# EAGLE design LDR 01 (EAGLE 8.0.2)
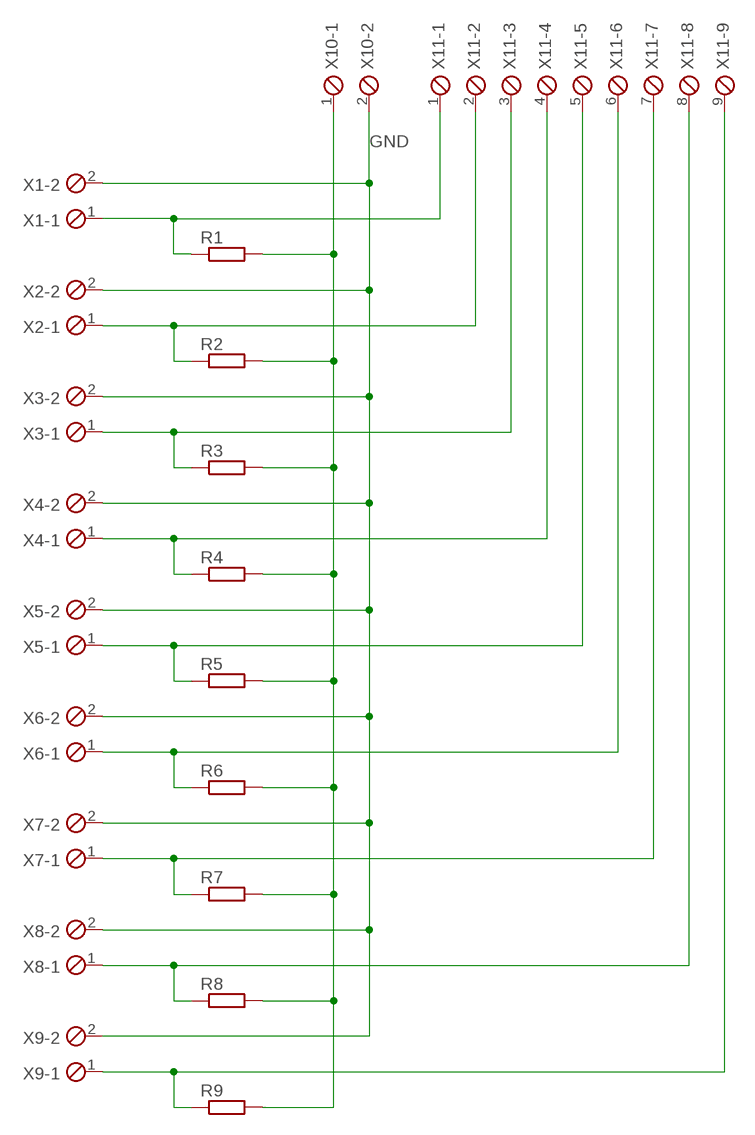
[diagram p0: schematic, sheet 1]

## Parts
R1  R-EU_0204/7  [0204/7]
R2  R-EU_0204/7  [0204/7]
R3  R-EU_0204/7  [0204/7]
R4  R-EU_0204/7  [0204/7]
R5  R-EU_0204/7  [0204/7]
R6  R-EU_0204/7  [0204/7]
R7  R-EU_0204/7  [0204/7]
R8  R-EU_0204/7  [0204/7]
R9  R-EU_0204/7  [0204/7]
X1  MPT2  [2POL254]
X2  MPT2  [2POL254]
X3  MPT2  [2POL254]
X4  MPT2  [2POL254]
X5  MPT2  [2POL254]
X6  MPT2  [2POL254]
X7  MPT2  [2POL254]
X8  MPT2  [2POL254]
X9  MPT2  [2POL254]
X10  MPT2  [2POL254]
X11  MPT9  [9POL254]

## Nets
GND: X1.2 X2.2 X3.2 X4.2 X5.2 X6.2 X7.2 X8.2 X9.2 X10.2
N$1: R1.2 R2.2 R3.2 R4.2 R5.2 R6.2 R7.2 R8.2 R9.2 X10.1
N$2: R1.1 X1.1 X11.1
N$4: R2.1 X2.1 X11.2
N$5: R3.1 X3.1 X11.3
N$6: R4.1 X4.1 X11.4
N$7: R5.1 X5.1 X11.5
N$8: R6.1 X6.1 X11.6
N$9: R7.1 X7.1 X11.7
N$10: R8.1 X8.1 X11.8
N$11: R9.1 X9.1 X11.9

## Library data of the parts
R1-R9 = rcl:R-EU_: RESISTOR, European symbol
X1-X10 = con-phoenix-254:MPT2: PHOENIX CONNECTOR; OC_FARNELL: unknown; OC_NEWARK: unknown
X11 = con-phoenix-254:MPT9: PHOENIX CONNECTOR; OC_FARNELL: unknown; OC_NEWARK: unknown

## Board
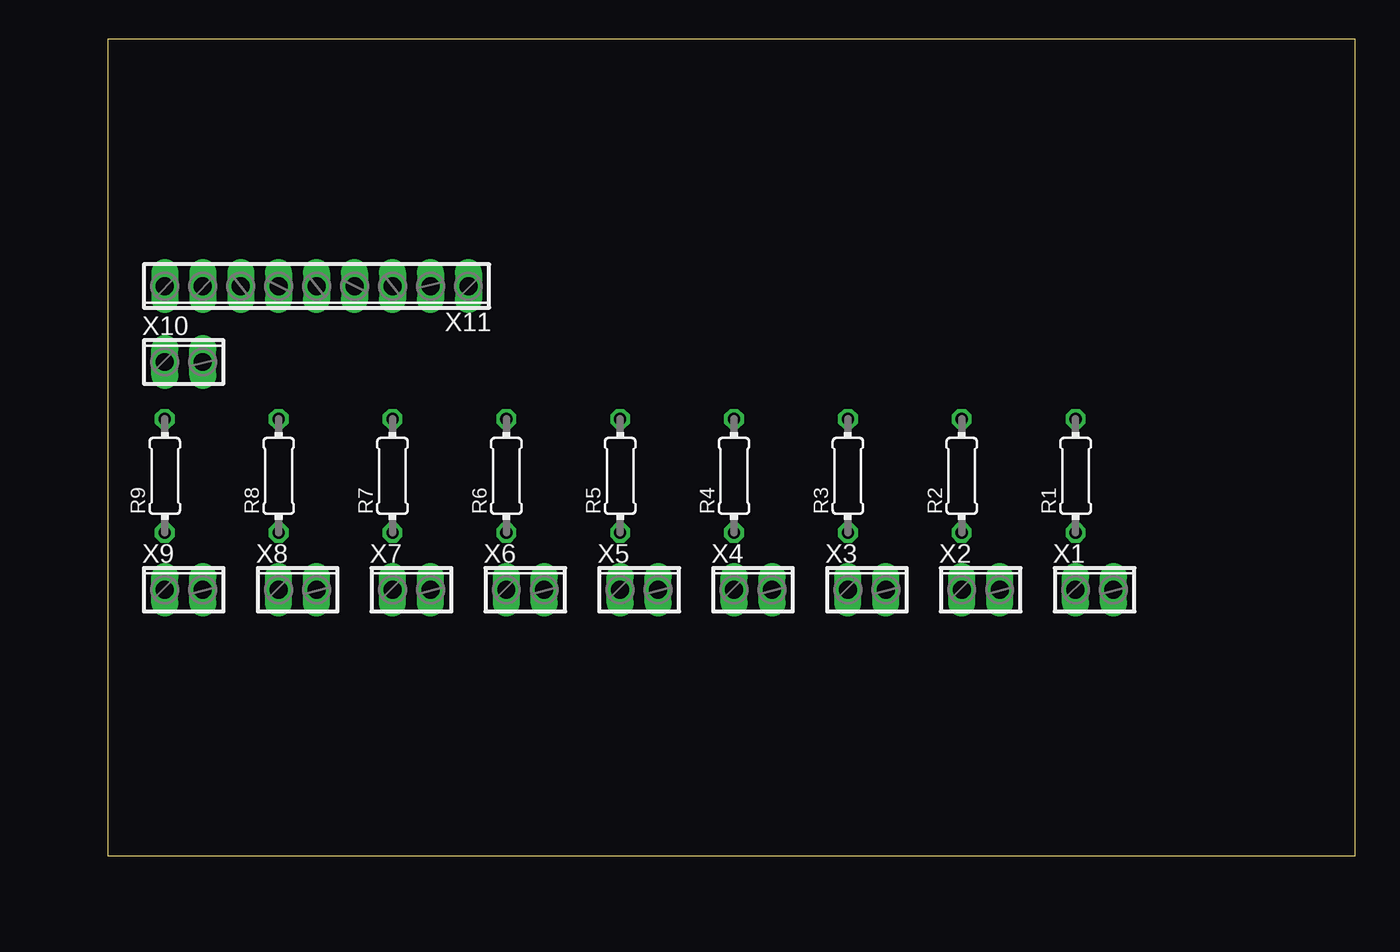
[diagram p1: board, top side]
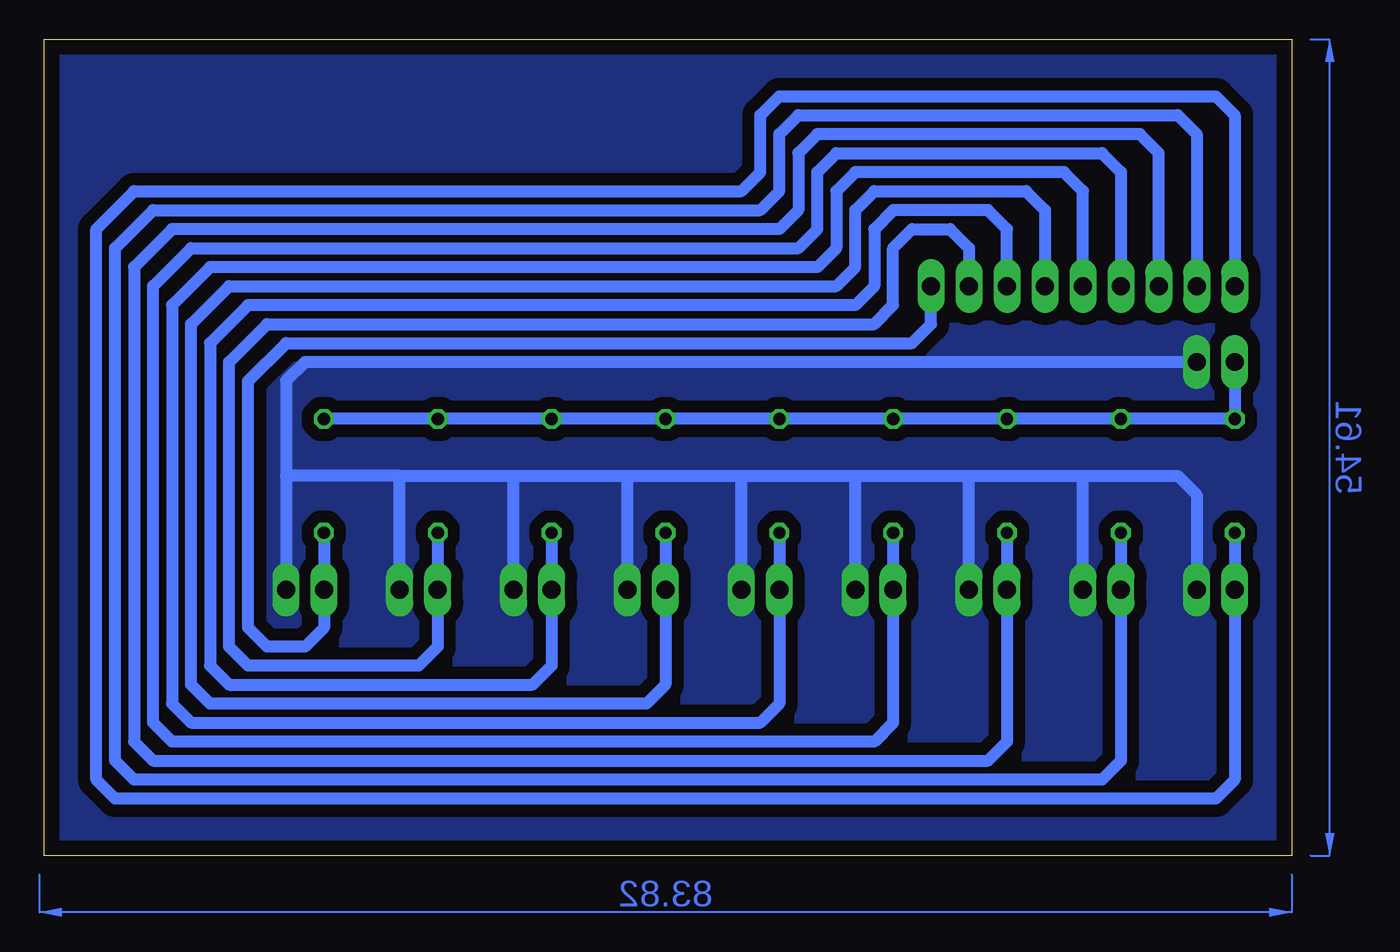
[diagram p2: board, bottom side, seen from below]

Size 83.49 x 54.6 mm. Coordinates in mm from the lower left corner, seen from the top.
Outline: 0,0 83.49,0 83.49,54.6 0,54.6 0,0
Copper layers (1*16): Top 0.035mm / dielectric 1.5mm / Bottom 0.035mm
Design rules "default *": minimum track width 40mil, minimum drill 24mil, track to track 8mil, track to pad 8mil, pad to pad 8mil, via to via 8mil, smd to smd 8mil, copper to edge 40mil, drill to drill 8mil, minimum pad ring 10mil, minimum via ring 8mil, stop-mask expansion 4mil, vias tented up to drill 0mil, thermal gap 10mil

### Footprints (pad centres in the part's own frame; a part is rotated, then mirrored left to right if it is on the bottom)
0204/7 = drill 0.813 octagon: 1 -3.81,0; 2 3.81,0
2POL254 = drill 1.2 long: 1 -1.27,0; 2 1.27,0
9POL254 = drill 1.2 long: 1 -10.16,0; 2 -7.62,0; 3 -5.08,0; 4 -2.54,0; 5 0,0; 6 2.54,0; 7 5.08,0; 8 7.62,0; 9 10.16,0

### Placement (x,y rotation side)
R1  64.77,25.4 90 top
R2  57.15,25.4 90 top
R3  49.53,25.4 90 top
R4  41.91,25.4 90 top
R5  34.29,25.4 90 top
R6  26.67,25.4 90 top
R7  19.05,25.4 90 top
R8  11.43,25.4 90 top
R9  3.81,25.4 90 top
X1  66.04,17.78 0 top
X2  58.42,17.78 0 top
X3  50.8,17.78 0 top
X4  43.18,17.78 0 top
X5  35.56,17.78 0 top
X6  27.94,17.78 0 top
X7  20.32,17.78 0 top
X8  12.7,17.78 0 top
X9  5.08,17.78 0 top
X10  5.08,33.02 0 top
X11  13.97,38.1 180 top

### Tracks (layer width: path | path; a pad name or v marks a point on that pad's centre or on a via)
GND
  Bottom 0.813: X10.2 66.04,33.02 67.31,31.75 67.31,25.4 | 67.31,25.4 X1.2 | 21.59,25.4 13.97,25.4 | 29.21,25.4 21.59,25.4 | 36.83,25.4 29.21,25.4 | 44.45,25.4 36.83,25.4 | 52.07,25.4 44.45,25.4 | 59.69,25.4 52.07,25.4 | 59.69,25.4 67.31,25.4 | 13.97,25.4 7.62,25.4 6.35,24.13 X9.2 | X8.2 13.97,25.4 | X7.2 21.59,25.4 | X6.2 29.21,25.4 | X5.2 36.83,25.4 | X4.2 44.45,25.4 | X3.2 52.07,25.4 | X2.2 59.69,25.4
  pour Bottom (isolate 0.813, no thermals): 0,0 0,54.61 83.82,54.61 83.82,0
N$1
  Bottom 0.813: X10.1 R9.2 R8.2 R7.2 R6.2 R5.2 R4.2 R3.2 R2.2 R1.2
N$2
  Bottom 0.813: X11.1 24.13,35.56 25.4,34.29 67.31,34.29 69.85,31.75 69.85,15.24 68.58,13.97 66.04,13.97 64.77,15.24 X1.1 R1.1
N$4
  Bottom 0.813: X11.2 21.59,40.64 22.86,41.91 25.4,41.91 26.67,40.64 26.67,36.83 27.94,35.56 68.58,35.56 71.12,33.02 71.12,13.97 69.85,12.7 58.42,12.7 57.15,13.97 X2.1 R2.1
N$5
  Bottom 0.813: X11.3 19.05,41.91 20.32,43.18 26.67,43.18 27.94,41.91 27.94,38.1 29.21,36.83 69.85,36.83 72.39,34.29 72.39,12.7 71.12,11.43 50.8,11.43 49.53,12.7 X3.1 R3.1
N$6
  Bottom 0.813: X11.4 16.51,43.18 17.78,44.45 27.94,44.45 29.21,43.18 29.21,39.37 30.48,38.1 71.12,38.1 73.66,35.56 73.66,11.43 72.39,10.16 43.18,10.16 41.91,11.43 X4.1 R4.1
N$7
  Bottom 0.813: X11.5 13.97,44.45 15.24,45.72 29.21,45.72 30.48,44.45 30.48,40.64 31.75,39.37 72.39,39.37 74.93,36.83 74.93,10.16 73.66,8.89 35.56,8.89 34.29,10.16 X5.1 R5.1
N$8
  Bottom 0.813: X11.6 11.43,45.72 12.7,46.99 30.48,46.99 31.75,45.72 31.75,41.91 33.02,40.64 73.66,40.64 76.2,38.1 76.2,8.89 74.93,7.62 27.94,7.62 26.67,8.89 X6.1 R6.1
N$9
  Bottom 0.813: X11.7 8.89,46.99 10.16,48.26 31.75,48.26 33.02,46.99 33.02,43.18 34.29,41.91 74.93,41.91 77.47,39.37 77.47,7.62 76.2,6.35 20.32,6.35 19.05,7.62 X7.1 R7.1
N$10
  Bottom 0.813: X11.8 6.35,48.26 7.62,49.53 33.02,49.53 34.29,48.26 34.29,44.45 35.56,43.18 76.2,43.18 78.74,40.64 78.74,6.35 77.47,5.08 12.7,5.08 11.43,6.35 X8.1 R8.1
N$11
  Bottom 0.813: X11.9 3.81,49.53 5.08,50.8 34.29,50.8 35.56,49.53 35.56,45.72 36.83,44.45 77.47,44.45 80.01,41.91 80.01,5.08 78.74,3.81 5.08,3.81 3.81,5.08 X9.1 R9.1
(copper drawn outside any net)
  shapes: Bottom area x2